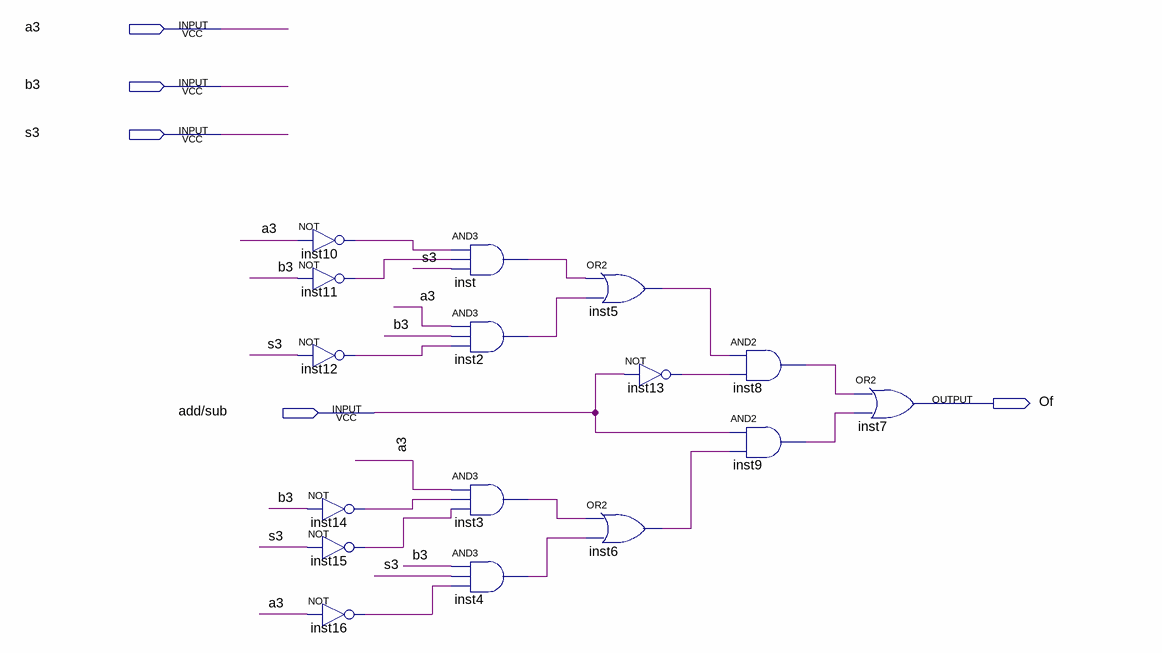
[diagram p0: schematic sheet]
// Quartus schematic overflow.bdf as structural Verilog: 16 symbols, 5 pins
module overflow (
  input  a3,
  input  b3,
  input  s3,
  input  \add/sub ,
  output Of
);

  wire inst2_out, inst3_out, inst4_out, inst5_out, inst6_out, inst8_out, inst9_out, inst10_out, inst11_out,
       inst12_out, inst13_out, inst14_out, inst15_out, inst16_out, inst_out;

  not inst10 (inst10_out, a3);
  not inst11 (inst11_out, b3);
  not inst12 (inst12_out, s3);
  not inst14 (inst14_out, b3);
  not inst15 (inst15_out, s3);
  not inst16 (inst16_out, a3);
  and inst (inst_out, inst10_out, inst11_out, s3);
  and inst2 (inst2_out, a3, b3, inst12_out);
  and inst3 (inst3_out, a3, inst14_out, inst15_out);
  and inst4 (inst4_out, b3, s3, inst16_out);
  or inst5 (inst5_out, inst_out, inst2_out);
  not inst13 (inst13_out, \add/sub );
  or inst6 (inst6_out, inst3_out, inst4_out);
  and inst8 (inst8_out, inst5_out, inst13_out);
  and inst9 (inst9_out, \add/sub , inst6_out);
  or inst7 (Of, inst8_out, inst9_out);
endmodule
